# Altium schematic sheet Gastroscopy-CutController_Overview.SchDoc: Overview
size 279 x 215 mm; Date: not used; ApprovedBy: not used; CheckedBy: not used; Author: not used; DrawnBy: not used; Organization: not used; Address4: not used; SheetNumber: 2; SheetTotal: 8; Time: not used; ImagePath: not used; Application_BuildNumber: not used
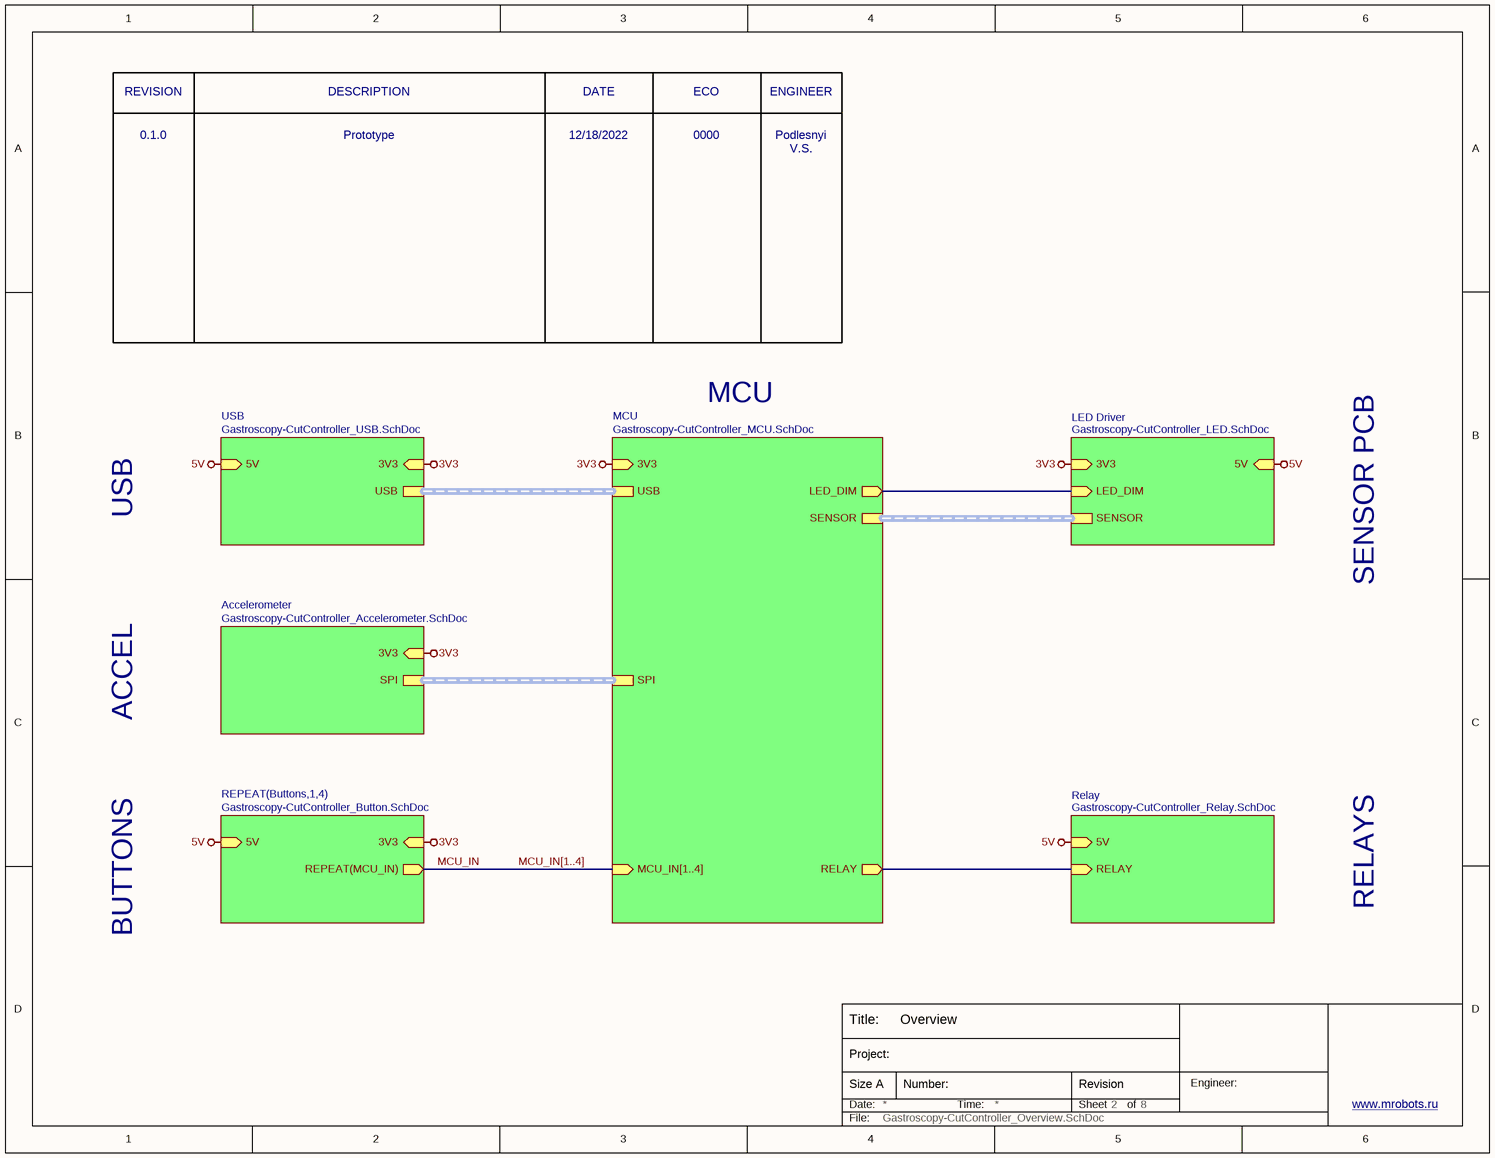
[diagram p0: Gastroscopy-CutController_Overview.SchDoc]

## Sub-sheets
Accelerometer = Gastroscopy-CutController_Accelerometer.SchDoc: 3V3 (in), SPI (harness SPI)
LED Driver = Gastroscopy-CutController_LED.SchDoc: 5V (in), LED_DIM (in), SENSOR (harness SENSOR), 3V3 (in)
MCU = Gastroscopy-CutController_MCU.SchDoc: 3V3 (in), SPI (harness SPI), USB (harness USB), MCU_IN[1..4] (in), RELAY (out), SENSOR (harness SENSOR), LED_DIM (out)
Relay = Gastroscopy-CutController_Relay.SchDoc: 5V (in), RELAY (in)
REPEAT(Buttons,1,4) = Gastroscopy-CutController_Button.SchDoc: 3V3 (in), 5V (in), REPEAT(MCU_IN) (out)
USB = Gastroscopy-CutController_USB.SchDoc: 3V3 (in), USB (harness USB), 5V (in)

## Nets
3V3: sheet MCU/3V3, sheet USB/3V3, sheet Accelerometer/3V3, sheet REPEAT(Buttons,1,4)/3V3, sheet LED Driver/3V3
5V: sheet USB/5V, sheet REPEAT(Buttons,1,4)/5V, sheet Relay/5V, sheet LED Driver/5V
MCU_IN: sheet REPEAT(Buttons,1,4)/REPEAT(MCU_IN)
(unnamed): sheet MCU/RELAY, sheet Relay/RELAY
(unnamed): sheet MCU/LED_DIM, sheet LED Driver/LED_DIM

## Buses and harness runs
bus MCU_IN[1..4] = sheet MCU/MCU_IN[1..4]
harness sheet Accelerometer/SPI = sheet MCU/SPI
harness sheet LED Driver/SENSOR = sheet MCU/SENSOR
harness sheet MCU/USB = sheet USB/USB

## Notes on the sheet
- REVISION
- DESCRIPTION
- DATE
- ECO
- ENGINEER
- 0.1.0
- Prototype
- 12/18/2022
- 0000
- Podlesnyi V.S.
- MCU
- USB
- SENSOR PCB
- ACCEL
- RELAYS
- BUTTONS
- Title:
- Date:
- Size A
- Project:
- Number:
- Time:
- Sheet
- Revision
- of
- Engineer:
- www.mrobots.ru <http://mrobots.ru/>
- File: